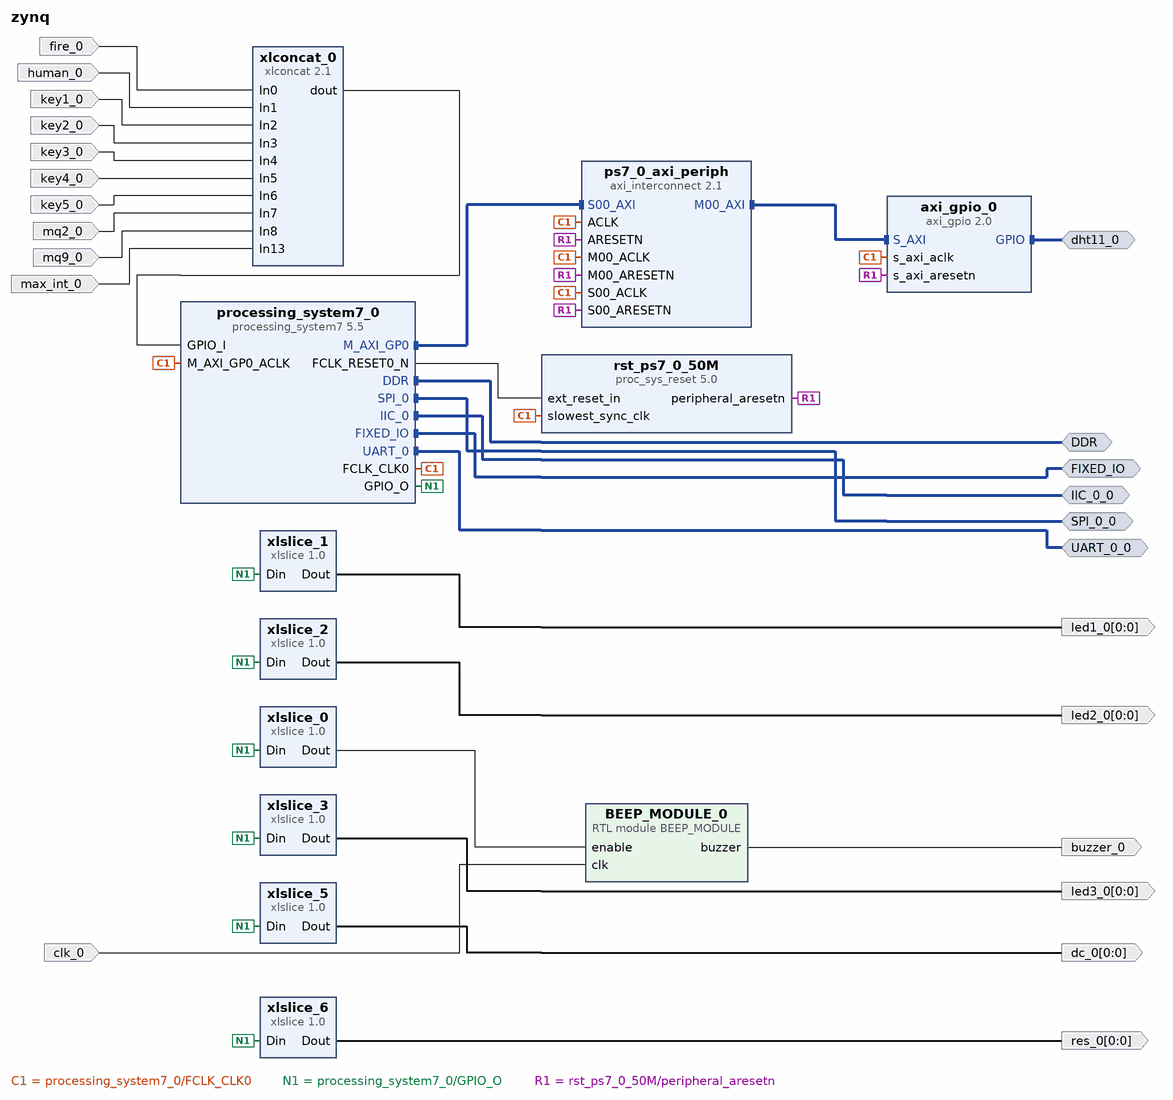
[diagram p0: block diagram of the top level]
# Vivado block design zynq, xc7z010clg400-1, Vivado 2018.3
create_bd_design zynq

create_bd_intf_port -mode Master -vlnv xilinx.com:interface:ddrx_rtl:1.0 DDR
create_bd_intf_port -mode Master -vlnv xilinx.com:display_processing_system7:fixedio_rtl:1.0 FIXED_IO
create_bd_intf_port -mode Master -vlnv xilinx.com:interface:uart_rtl:1.0 UART_0_0
create_bd_intf_port -mode Master -vlnv xilinx.com:interface:iic_rtl:1.0 IIC_0_0
create_bd_intf_port -mode Master -vlnv xilinx.com:interface:spi_rtl:1.0 SPI_0_0
create_bd_intf_port -mode Master -vlnv xilinx.com:interface:gpio_rtl:1.0 dht11_0
create_bd_port -dir O buzzer_0
create_bd_port -dir I -type clk clk_0
create_bd_port -dir O -from 0 -to 0 res_0
create_bd_port -dir O -from 0 -to 0 dc_0
create_bd_port -dir O -from 0 -to 0 led3_0
create_bd_port -dir O -from 0 -to 0 led2_0
create_bd_port -dir O -from 0 -to 0 led1_0
create_bd_port -dir I key5_0
create_bd_port -dir I key4_0
create_bd_port -dir I key3_0
create_bd_port -dir I key2_0
create_bd_port -dir I key1_0
create_bd_port -dir I mq9_0
create_bd_port -dir I mq2_0
create_bd_port -dir I human_0
create_bd_port -dir I fire_0
create_bd_port -dir I max_int_0

create_bd_cell -type ip -vlnv xilinx.com:ip:processing_system7:5.5 processing_system7_0
set_property -dict [list \
  CONFIG.PCW_GPIO_EMIO_GPIO_ENABLE 1 \
  CONFIG.PCW_GPIO_EMIO_GPIO_IO 16 \
  CONFIG.PCW_GPIO_EMIO_GPIO_WIDTH 16 \
  CONFIG.PCW_I2C0_I2C0_IO EMIO \
  CONFIG.PCW_I2C0_PERIPHERAL_ENABLE 1 \
  CONFIG.PCW_I2C_PERIPHERAL_FREQMHZ 111.111115 \
  CONFIG.PCW_NAND_NAND_IO {MIO 0 2.. 14} \
  CONFIG.PCW_NAND_PERIPHERAL_ENABLE 1 \
  CONFIG.PCW_SPI0_PERIPHERAL_ENABLE 1 \
  CONFIG.PCW_SPI0_SPI0_IO EMIO \
  CONFIG.PCW_UART0_PERIPHERAL_ENABLE 1 \
  CONFIG.PCW_UART0_UART0_IO EMIO \
  CONFIG.PCW_UART1_PERIPHERAL_ENABLE 1 \
  CONFIG.PCW_UART1_UART1_IO {MIO 24 .. 25} \
  CONFIG.PCW_UART_PERIPHERAL_FREQMHZ 100 \
  CONFIG.PCW_UIPARAM_DDR_BUS_WIDTH {16 Bit} \
  CONFIG.PCW_UIPARAM_DDR_PARTNO {MT41K128M16 JT-125} \
] [get_bd_cells processing_system7_0]
# 98 more settings of processing_system7_0 are not shown: defaults, MIO pin electricals, DDR timing, and values the tool derives
create_bd_cell -type module -reference BEEP_MODULE BEEP_MODULE_0
create_bd_cell -type ip -vlnv xilinx.com:ip:xlconcat:2.1 xlconcat_0
set_property -dict {CONFIG.NUM_PORTS 16} [get_bd_cells xlconcat_0]
create_bd_cell -type ip -vlnv xilinx.com:ip:xlslice:1.0 xlslice_0
set_property -dict {CONFIG.DIN_FROM 9 CONFIG.DIN_TO 9 CONFIG.DIN_WIDTH 16 CONFIG.DOUT_WIDTH 1} [get_bd_cells xlslice_0]
create_bd_cell -type ip -vlnv xilinx.com:ip:xlslice:1.0 xlslice_1
set_property -dict {CONFIG.DIN_FROM 10 CONFIG.DIN_TO 10 CONFIG.DIN_WIDTH 16 CONFIG.DOUT_WIDTH 1} [get_bd_cells xlslice_1]
create_bd_cell -type ip -vlnv xilinx.com:ip:xlslice:1.0 xlslice_2
set_property -dict {CONFIG.DIN_FROM 11 CONFIG.DIN_TO 11 CONFIG.DIN_WIDTH 16 CONFIG.DOUT_WIDTH 1} [get_bd_cells xlslice_2]
create_bd_cell -type ip -vlnv xilinx.com:ip:xlslice:1.0 xlslice_3
set_property -dict {CONFIG.DIN_FROM 12 CONFIG.DIN_TO 12 CONFIG.DIN_WIDTH 16 CONFIG.DOUT_WIDTH 1} [get_bd_cells xlslice_3]
create_bd_cell -type ip -vlnv xilinx.com:ip:xlslice:1.0 xlslice_5
set_property -dict {CONFIG.DIN_FROM 14 CONFIG.DIN_TO 14 CONFIG.DIN_WIDTH 16 CONFIG.DOUT_WIDTH 1} [get_bd_cells xlslice_5]
create_bd_cell -type ip -vlnv xilinx.com:ip:xlslice:1.0 xlslice_6
set_property -dict {CONFIG.DIN_FROM 15 CONFIG.DIN_TO 15 CONFIG.DIN_WIDTH 16 CONFIG.DOUT_WIDTH 1} [get_bd_cells xlslice_6]
create_bd_cell -type ip -vlnv xilinx.com:ip:axi_gpio:2.0 axi_gpio_0
set_property -dict {CONFIG.C_GPIO_WIDTH 1} [get_bd_cells axi_gpio_0]
create_bd_cell -type ip -vlnv xilinx.com:ip:axi_interconnect:2.1 ps7_0_axi_periph
set_property -dict {CONFIG.NUM_MI 1} [get_bd_cells ps7_0_axi_periph]
create_bd_cell -type ip -vlnv xilinx.com:ip:proc_sys_reset:5.0 rst_ps7_0_50M

# ---- connections ----

connect_bd_intf_net [get_bd_intf_ports SPI_0_0] [get_bd_intf_pins processing_system7_0/SPI_0]
connect_bd_intf_net [get_bd_intf_ports DDR] [get_bd_intf_pins processing_system7_0/DDR]
connect_bd_intf_net [get_bd_intf_ports dht11_0] [get_bd_intf_pins axi_gpio_0/GPIO]
connect_bd_intf_net [get_bd_intf_pins processing_system7_0/M_AXI_GP0] [get_bd_intf_pins ps7_0_axi_periph/S00_AXI]
connect_bd_intf_net [get_bd_intf_ports IIC_0_0] [get_bd_intf_pins processing_system7_0/IIC_0]
connect_bd_intf_net [get_bd_intf_pins ps7_0_axi_periph/M00_AXI] [get_bd_intf_pins axi_gpio_0/S_AXI]
connect_bd_intf_net [get_bd_intf_ports UART_0_0] [get_bd_intf_pins processing_system7_0/UART_0]
connect_bd_intf_net [get_bd_intf_ports FIXED_IO] [get_bd_intf_pins processing_system7_0/FIXED_IO]
connect_bd_net [get_bd_pins processing_system7_0/FCLK_CLK0] \
  [get_bd_pins processing_system7_0/M_AXI_GP0_ACLK] [get_bd_pins ps7_0_axi_periph/S00_ACLK] \
  [get_bd_pins rst_ps7_0_50M/slowest_sync_clk] [get_bd_pins axi_gpio_0/s_axi_aclk] [get_bd_pins ps7_0_axi_periph/M00_ACLK] \
  [get_bd_pins ps7_0_axi_periph/ACLK]
connect_bd_net [get_bd_pins BEEP_MODULE_0/buzzer] [get_bd_ports buzzer_0]
connect_bd_net -net clk_0_1 [get_bd_ports clk_0] [get_bd_pins BEEP_MODULE_0/clk]
connect_bd_net -net fire_0_1 [get_bd_ports fire_0] [get_bd_pins xlconcat_0/In0]
connect_bd_net -net human_0_1 [get_bd_ports human_0] [get_bd_pins xlconcat_0/In1]
connect_bd_net -net key1_0_1 [get_bd_ports key1_0] [get_bd_pins xlconcat_0/In2]
connect_bd_net -net key2_0_1 [get_bd_ports key2_0] [get_bd_pins xlconcat_0/In3]
connect_bd_net -net key3_0_1 [get_bd_ports key3_0] [get_bd_pins xlconcat_0/In4]
connect_bd_net -net key4_0_1 [get_bd_ports key4_0] [get_bd_pins xlconcat_0/In5]
connect_bd_net -net key5_0_1 [get_bd_ports key5_0] [get_bd_pins xlconcat_0/In6]
connect_bd_net -net mq2_0_1 [get_bd_ports mq2_0] [get_bd_pins xlconcat_0/In7]
connect_bd_net -net mq9_0_1 [get_bd_ports mq9_0] [get_bd_pins xlconcat_0/In8]
connect_bd_net [get_bd_pins xlconcat_0/dout] [get_bd_pins processing_system7_0/GPIO_I]
connect_bd_net [get_bd_pins xlslice_0/Dout] [get_bd_pins BEEP_MODULE_0/enable]
connect_bd_net [get_bd_pins xlslice_1/Dout] [get_bd_ports led1_0]
connect_bd_net [get_bd_pins xlslice_2/Dout] [get_bd_ports led2_0]
connect_bd_net [get_bd_pins xlslice_3/Dout] [get_bd_ports led3_0]
connect_bd_net [get_bd_pins xlslice_5/Dout] [get_bd_ports dc_0]
connect_bd_net [get_bd_pins xlslice_6/Dout] [get_bd_ports res_0]
connect_bd_net [get_bd_pins processing_system7_0/GPIO_O] \
  [get_bd_pins xlslice_3/Din] [get_bd_pins xlslice_5/Din] [get_bd_pins xlslice_6/Din] [get_bd_pins xlslice_2/Din] \
  [get_bd_pins xlslice_1/Din] [get_bd_pins xlslice_0/Din]
connect_bd_net [get_bd_pins processing_system7_0/FCLK_RESET0_N] [get_bd_pins rst_ps7_0_50M/ext_reset_in]
connect_bd_net [get_bd_pins rst_ps7_0_50M/peripheral_aresetn] \
  [get_bd_pins ps7_0_axi_periph/S00_ARESETN] [get_bd_pins axi_gpio_0/s_axi_aresetn] \
  [get_bd_pins ps7_0_axi_periph/M00_ARESETN] [get_bd_pins ps7_0_axi_periph/ARESETN]
connect_bd_net -net max_int_0_1 [get_bd_ports max_int_0] [get_bd_pins xlconcat_0/In13]

# ---- address map ----
assign_bd_address -offset 0x41200000 -range 64K -target_address_space [get_bd_addr_spaces processing_system7_0/Data] [get_bd_addr_segs axi_gpio_0/S_AXI/Reg]

validate_bd_design
save_bd_design
